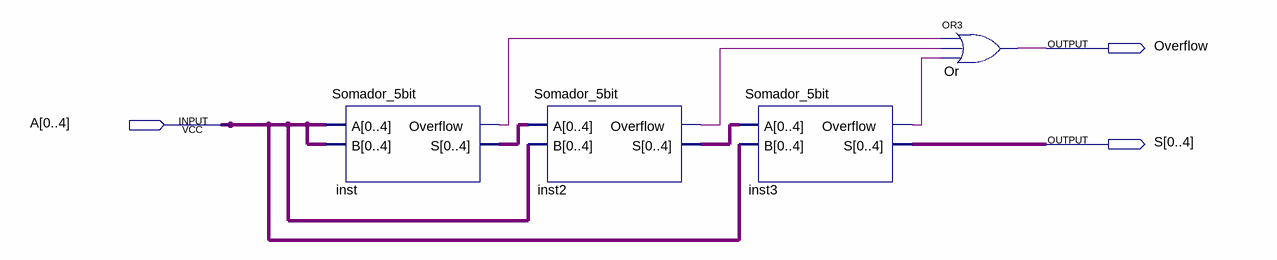
[diagram p0: schematic sheet]
// Quartus schematic Ax4.bdf as structural Verilog: 4 symbols, 3 pins
module Ax4 (
  input  [0:4] A,
  output Overflow,
  output [0:4] S
);

  wire inst2_overflow, inst3_overflow, inst_overflow;
  wire [4:0] inst2_s, inst_s;

  Somador_5bit inst (.A(A), .B(A), .Overflow(inst_overflow), .S(inst_s));
  Somador_5bit inst2 (.A(inst_s), .B(A), .Overflow(inst2_overflow), .S(inst2_s));
  Somador_5bit inst3 (.A(inst2_s), .B(A), .Overflow(inst3_overflow), .S(S));
  or Or (Overflow, inst_overflow, inst2_overflow, inst3_overflow);
endmodule
